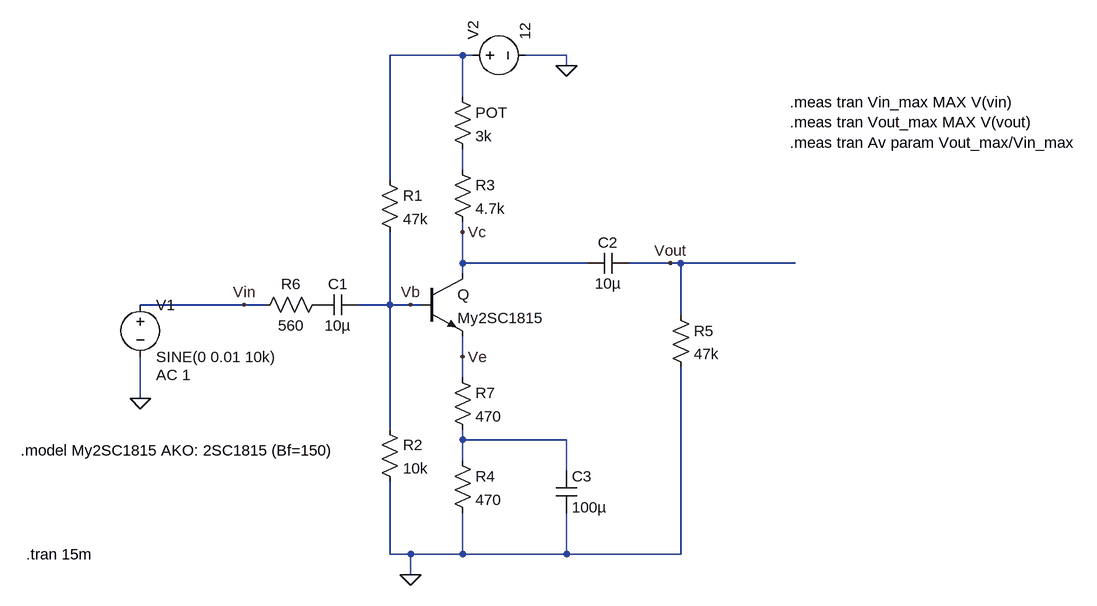
[diagram p0: schematic H2AC.asc]
H2AC.asc, the LTspice schematic file:
Version 4.1
SHEET 1 1132 736
WIRE 144 -192 32 -192
WIRE 160 -192 144 -192
WIRE 304 -192 240 -192
WIRE 304 -176 304 -192
WIRE 144 -128 144 -192
WIRE 144 -16 144 -48
WIRE 32 0 32 -192
WIRE 144 80 144 64
WIRE 144 128 144 80
WIRE 336 128 144 128
WIRE 464 128 400 128
WIRE 480 128 464 128
WIRE 656 128 480 128
WIRE 144 144 144 128
WIRE -192 192 -352 192
WIRE -160 192 -192 192
WIRE 32 192 32 80
WIRE 32 192 -16 192
WIRE 64 192 32 192
WIRE 80 192 64 192
WIRE 480 208 480 128
WIRE 144 272 144 240
WIRE 144 304 144 272
WIRE -352 336 -352 272
WIRE 32 384 32 192
WIRE 144 400 144 384
WIRE 304 400 144 400
WIRE 144 432 144 400
WIRE 304 448 304 400
WIRE 32 576 32 464
WIRE 64 576 32 576
WIRE 144 576 144 512
WIRE 144 576 64 576
WIRE 304 576 304 512
WIRE 304 576 144 576
WIRE 480 576 480 288
WIRE 480 576 304 576
WIRE 64 608 64 576
FLAG 64 608 0
FLAG 304 -176 0
FLAG -352 336 0
FLAG 64 192 Vb
FLAG 144 272 Ve
FLAG 144 80 Vc
FLAG 464 128 Vout
FLAG -192 192 Vin
SYMBOL npn 80 144 R0
SYMATTR InstName Q
SYMATTR Value My2SC1815
SYMBOL cap -16 176 R90
WINDOW 0 0 32 VBottom 2
WINDOW 3 32 32 VTop 2
SYMATTR InstName C1
SYMATTR Value 10µ
SYMBOL res 16 -16 R0
SYMATTR InstName R1
SYMATTR Value 47k
SYMBOL res 128 -32 R0
SYMATTR InstName R3
SYMATTR Value 4.7k
SYMBOL voltage 144 -192 R270
WINDOW 123 0 0 Left 0
WINDOW 39 0 0 Left 0
SYMATTR InstName V2
SYMATTR Value 12
SYMBOL cap 400 112 R90
WINDOW 0 0 32 VBottom 2
WINDOW 3 32 32 VTop 2
SYMATTR InstName C2
SYMATTR Value 10µ
SYMBOL res 464 192 R0
SYMATTR InstName R5
SYMATTR Value 47k
SYMBOL res 128 416 R0
SYMATTR InstName R4
SYMATTR Value 470
SYMBOL cap 288 448 R0
SYMATTR InstName C3
SYMATTR Value 100µ
SYMBOL res 16 368 R0
SYMATTR InstName R2
SYMATTR Value 10k
SYMBOL res -64 176 R90
WINDOW 0 0 56 VBottom 2
WINDOW 3 32 56 VTop 2
SYMATTR InstName R6
SYMATTR Value 560
SYMBOL res 128 288 R0
SYMATTR InstName R7
SYMATTR Value 470
SYMBOL voltage -352 176 R0
WINDOW 123 24 124 Left 2
WINDOW 39 0 0 Left 0
SYMATTR Value2 AC 1
SYMATTR InstName V1
SYMATTR Value SINE(0 0.01 10k)
SYMBOL res 128 -144 R0
SYMATTR InstName POT
SYMATTR Value 3k
TEXT -536 416 Left 2 !.model My2SC1815 AKO: 2SC1815 (Bf=150)
TEXT -528 576 Left 2 !.tran 15m
TEXT 648 -120 Left 2 !.meas tran Vin_max MAX V(vin)\n.meas tran Vout_max MAX V(vout)\n.meas tran Av param Vout_max/Vin_max

The netlist it stands for:
* H2AC.asc
Q Vc Vb Ve 0 My2SC1815
C1 Vb P001 10µ
R1 N001 Vb 47k
R3 N002 Vc 4.7k
V2 N001 0 12
C2 Vout Vc 10µ
R5 Vout 0 47k
R4 N003 0 470
C3 N003 0 100µ
R2 Vb 0 10k
R6 P001 Vin 560
R7 Ve N003 470
V1 Vin 0 SINE(0 0.01 10k) AC 1
R§POT N001 N002 3k
.model NPN NPN
.model PNP PNP
.lib standard.bjt
.model My2SC1815 AKO: 2SC1815 (Bf=150)
.tran 15m
.meas tran Vin_max MAX V(vin)
.meas tran Vout_max MAX V(vout)
.meas tran Av param Vout_max/Vin_max
.backanno
.end